# EAGLE design octo_driver (EAGLE 6.4)
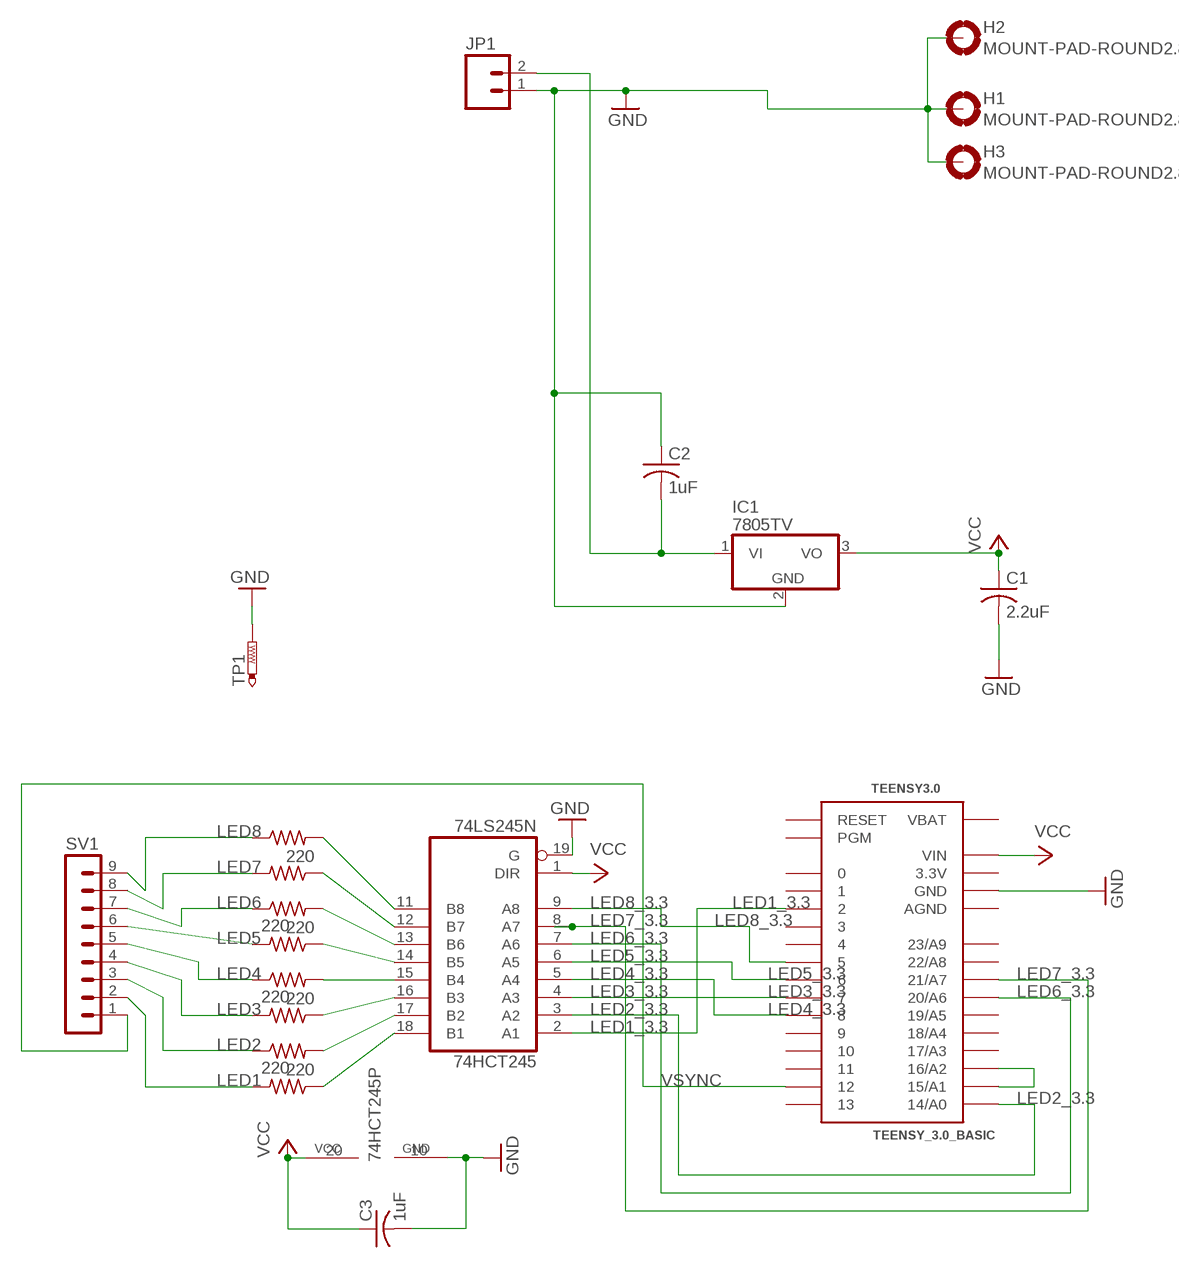
[diagram p0: schematic, sheet 1]

## Parts
74HCT245  74LS245N  [DIL20]
C1  2.2uF  C-US025-024X044  [C025-024X044]
C2  1uF  C-US025-024X044  [C025-024X044]
C3  1uF  C-US025-024X044  [C025-024X044]
H1  MOUNT-PAD-ROUND2.8  [2,8-PAD]
H2  MOUNT-PAD-ROUND2.8  [2,8-PAD]
H3  MOUNT-PAD-ROUND2.8  [2,8-PAD]
IC1  7805TV  [TO220V]
JP1  M02PTH  [1X02]
RLED1  220  R-US_0207/2V  [0207/2V]
RLED8  220  R-US_0207/2V  [0207/2V]
RLED9  220  R-US_0207/2V  [0207/2V]
RLED10  220  R-US_0207/2V  [0207/2V]
RLED11  220  R-US_0207/2V  [0207/2V]
RLED12  220  R-US_0207/2V  [0207/2V]
RLED13  220  R-US_0207/2V  [0207/2V]
RLED14  220  R-US_0207/2V  [0207/2V]
SV1  MA09-1  [MA09-1]
TEENSY3.0  TEENSY_3.0_BASIC  [TEENSY_3.0_BASIC]
TP1  PTR1B2,54  [B2,54]

## Nets
GND: 74HCT245.10(GND) 74HCT245.19(G) C1.2 C2.1 C3.2 H1.B2,8(MOUNT) H2.B2,8(MOUNT) H3.B2,8(MOUNT) IC1.2(GND) JP1.1 TEENSY3.0.GND TEENSY3.0.GND1(GND) TP1.TP
LED1: RLED14.2 SV1.2
LED1_3.3: 74HCT245.2(A1) TEENSY3.0.2
LED2: RLED13.1 SV1.3
LED2_3.3: 74HCT245.3(A2) TEENSY3.0.14/A0
LED3: RLED12.2 SV1.4
LED3_3.3: 74HCT245.4(A3) TEENSY3.0.7
LED4: RLED11.1 SV1.5
LED4_3.3: 74HCT245.5(A4) TEENSY3.0.8
LED5: RLED10.2 SV1.6
LED5_3.3: 74HCT245.6(A5) TEENSY3.0.6
LED6: RLED9.1 SV1.7
LED6_3.3: 74HCT245.7(A6) TEENSY3.0.20/A6
LED7: RLED8.2 SV1.8
LED7_3.3: 74HCT245.8(A7) TEENSY3.0.21/A7
LED8: RLED1.1 SV1.9
LED8_3.3: 74HCT245.9(A8) TEENSY3.0.5
N$1: C2.2 IC1.1(VI) JP1.2
N$3: TEENSY3.0.15/A1 TEENSY3.0.16/A2
N$16: 74HCT245.11(B8) RLED1.2
N$17: 74HCT245.12(B7) RLED8.1
N$19: 74HCT245.13(B6) RLED9.2
N$20: 74HCT245.14(B5) RLED10.1
N$21: 74HCT245.15(B4) RLED11.2
N$22: 74HCT245.16(B3) RLED12.1
N$23: 74HCT245.17(B2) RLED13.2
N$24: 74HCT245.18(B1) RLED14.1
VCC: 74HCT245.1(DIR) 74HCT245.20(VCC) C1.1 C3.1 IC1.3(VO) TEENSY3.0.VIN
VSYNC: SV1.1 TEENSY3.0.12
Unconnected: TEENSY3.0.0 TEENSY3.0.1 TEENSY3.0.3 TEENSY3.0.4 TEENSY3.0.9 TEENSY3.0.10 TEENSY3.0.11 TEENSY3.0.13 TEENSY3.0.17/A3 TEENSY3.0.18/A4 TEENSY3.0.19/A5 TEENSY3.0.22/A8 TEENSY3.0.23/A9 TEENSY3.0.PGM TEENSY3.0.RESET

## Power pins joined to a net without a drawn wire
3.3V: TEENSY3.0.3.3V TEENSY3.0.3.3V1(3.3V)
AGND: TEENSY3.0.AGND
VBAT: TEENSY3.0.VBAT

## Library data of the parts
74HCT245 = 74xx-us:74*245: Octal BUS TRANSCEIVER, 3-state
C1-C3 = rcl:C-US: CAPACITOR, American symbol
H1-H3 = holes:MOUNT-PAD-ROUND: MOUNTING PAD, round
IC1 = linear:78*: Positive VOLTAGE REGULATOR Source: http://cache.national.com/ds/LM/LM78L05.pdf http://www.fairchildsemi.com/ds/LM/LM7805.pdf
JP1 = SparkFun-Connectors:M02: Header 2 Standard 2-pin 0.1" header. Use with straight break away headers (SKU : PRT-00116), right angle break away headers (PRT-00553), swiss pins (PRT-00743), machine pins (PRT-00117), and female headers (PRT-00115). Molex polarized connector foot print use with SKU : PRT-08233 with associated crimp pins and housings.
RLED1 RLED8-RLED14 = rcl:R-US_: RESISTOR, American symbol
SV1 = penrose-con-lstb:MA09-1: PIN HEADER; OC_FARNELL: unknown; OC_NEWARK: unknown
TEENSY3.0 = Teensy3.0:TEENSY_3.0_BASIC: Basic Teensy 3.0 with none of the 'inner' pins enabled. See '+4', 'AllAnalogPins", and 'AllPins' packages for additional pin holes, as needed.
TP1 = testpad:PTR1: TEST PIN

## Board
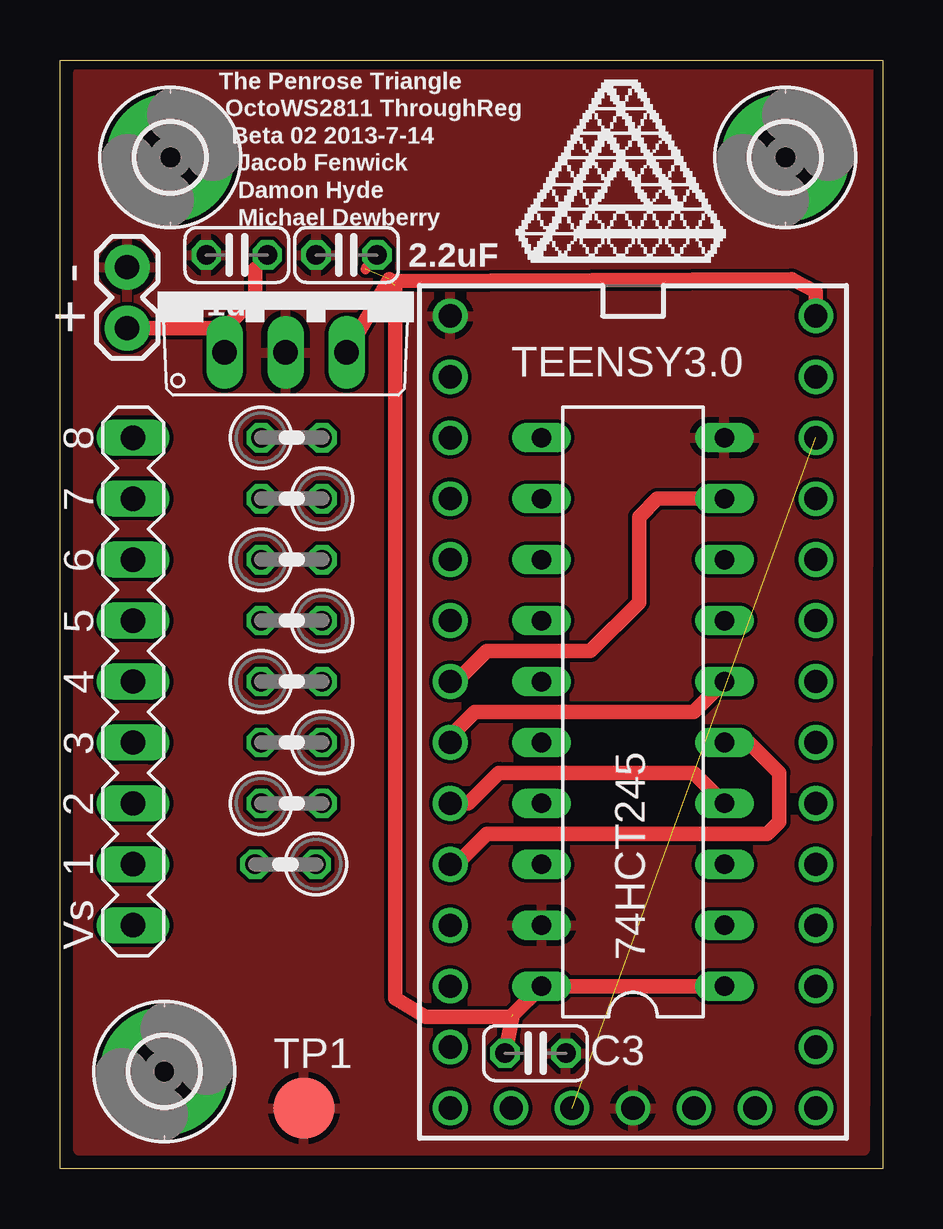
[diagram p1: board, top side]
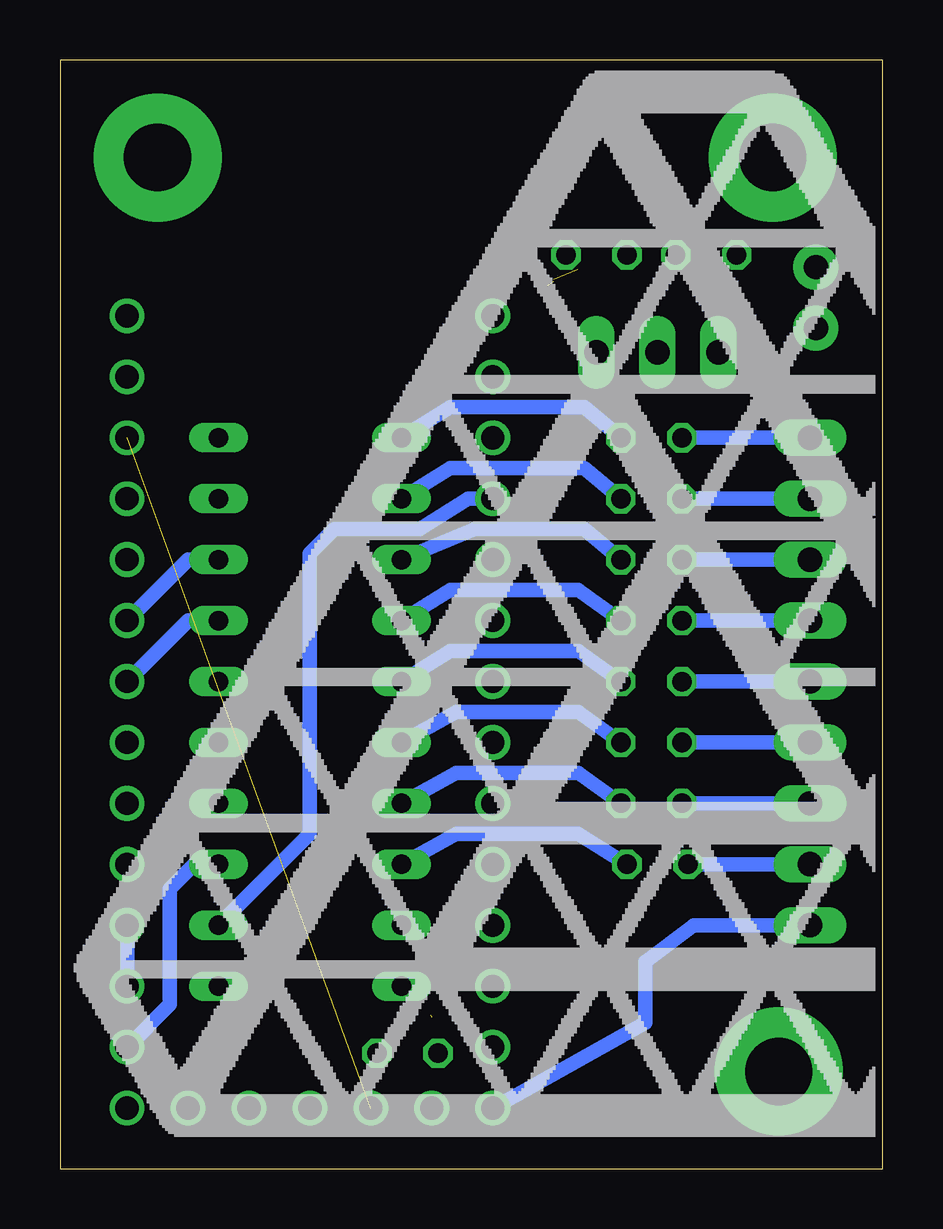
[diagram p2: board, bottom side, seen from below]

Size 34.29 x 46.23 mm. Coordinates in mm from the lower left corner, seen from the top.
Outline: 0,46.23 34.29,46.23 34.29,0 0,0 0,46.23
Copper layers (1*16): Top 0.0356mm / dielectric 1.5011mm / Bottom 0.0356mm
Design rules "LaenPCBOrder": minimum track width 6mil, minimum drill 13mil, track to track 6mil, track to pad 6mil, pad to pad 6mil, via to via 6mil, smd to smd 6mil, copper to edge 15mil, drill to drill 6mil, minimum pad ring 7mil, minimum via ring 7mil, stop-mask expansion 4mil, vias tented up to drill 0mil, thermal gap 10mil

### Footprints (pad centres in the part's own frame; a part is rotated, then mirrored left to right if it is on the bottom)
DIL20 = drill 0.813 long: 1 -11.43,-3.81; 2 -8.89,-3.81; 3 -6.35,-3.81; 4 -3.81,-3.81; 5 -1.27,-3.81; 6 1.27,-3.81; 7 3.81,-3.81; 8 6.35,-3.81; 9 8.89,-3.81; 10 11.43,-3.81; 11 11.43,3.81; 12 8.89,3.81; 13 6.35,3.81; 14 3.81,3.81; 15 1.27,3.81; 16 -1.27,3.81; 17 -3.81,3.81; 18 -6.35,3.81; 19 -8.89,3.81; 20 -11.43,3.81
C025-024X044 = drill 0.813 octagon: 1 -1.27,0; 2 1.27,0
2,8-PAD = drill 2.8 pad 5.334: B2,8 0,0
TO220V = drill 1.016 long: 1 -2.54,-2.54; 2 0,-2.54; 3 2.54,-2.54
1X02 = drill 1.016 pad 1.88: 1 0,0; 2 2.54,0
0207/2V = drill 0.813 octagon: 1 -1.27,0; 2 1.27,0
MA09-1 = drill 1.016 long: 1 -10.16,0; 2 -7.62,0; 3 -5.08,0; 4 -2.54,0; 5 0,0; 6 2.54,0; 7 5.08,0; 8 7.62,0; 9 10.16,0
TEENSY_3.0_BASIC = drill 0.965: 0 -7.62,13.97; 1 -7.62,11.43; 2 -7.62,8.89; 3 -7.62,6.35; 3.3V 7.62,11.43; 3.3V1 -2.54,-16.51; 4 -7.62,3.81; 5 -7.62,1.27; 6 -7.62,-1.27; 7 -7.62,-3.81; 8 -7.62,-6.35; 9 -7.62,-8.89; 10 -7.62,-11.43; 11 -7.62,-13.97; 12 -7.62,-16.51; 13 7.62,-16.51; 14/A0 7.62,-13.97; 15/A1 7.62,-11.43; 16/A2 7.62,-8.89; 17/A3 7.62,-6.35; 18/A4 7.62,-3.81; 19/A5 7.62,-1.27; 20/A6 7.62,1.27; 21/A7 7.62,3.81; 22/A8 7.62,6.35; 23/A9 7.62,8.89; AGND 7.62,13.97; GND -7.62,16.51; GND1 0,-16.51; PGM 2.54,-16.51; RESET 5.08,-16.51; VBAT -5.08,-16.51; VIN 7.62,16.51
B2,54 = smd 2.54 x 2.54: TP 0,0

### Placement (x,y rotation side)
74HCT245  23.88,19.05 90 top
C1  11.94,38.1 180 top
C2  7.37,38.1 0 top
C3  19.81,4.83 0 top
H1  4.34,4.06 0 top
H2  4.6,42.16 0 top
H3  30.23,42.16 0 top
IC1  9.4,36.58 0 top
JP1  2.79,37.59 270 top
RLED1  9.65,30.48 0 top
RLED8  9.65,27.94 180 top
RLED9  9.65,25.4 0 top
RLED10  9.65,22.86 180 top
RLED11  9.65,20.32 0 top
RLED12  9.65,17.78 180 top
RLED13  9.65,15.24 0 top
RLED14  9.4,12.7 180 top
SV1  3.05,20.32 90 top
TEENSY3.0  23.88,19.05 0 top
TP1  10.16,2.54 0 top
U$1  [PENROSELOGO_LOWDPI]  23.37,40.89 0 top
U$2  [PENROSELOGO_1.75IN]  8.13,20.32 0 top

### Tracks (layer width: path | path; a pad name or v marks a point on that pad's centre or on a via)
3.3V  (1 unrouted)
GND
  pour Top: 33.78,45.72 33.53,0.76 0.76,0.76 0.76,45.72
LED1
  Bottom 0.61: RLED14.2 SV1.2
LED1_3.3
  Bottom 0.61: TEENSY3.0.2 17.27,27.94 19.3,26.67 22.86,26.67 23.88,25.65 23.88,13.97 74HCT245.2
LED2
  Bottom 0.61: SV1.3 RLED13.1
LED2_3.3
  Bottom 0.61: 74HCT245.3 28.7,12.7 29.72,11.68 29.72,6.86 TEENSY3.0.14/A0
LED3
  Bottom 0.61: RLED12.2 SV1.4
LED3_3.3
  Top 0.61: TEENSY3.0.7 17.02,15.24 18.29,16.51 26.42,16.51 74HCT245.4
LED4
  Bottom 0.61: SV1.5 RLED11.1
LED4_3.3
  Top 0.61: TEENSY3.0.8 16.51,12.7 17.78,13.97 29.46,13.97 29.97,14.48 29.97,16.51 28.7,17.78 74HCT245.5
LED5
  Bottom 0.61: RLED10.2 SV1.6
LED5_3.3
  Top 0.61: TEENSY3.0.6 16.26,18.03 17.27,19.05 26.42,19.05 74HCT245.6
LED6
  Bottom 0.61: SV1.7 RLED9.1
LED6_3.3
  Bottom 0.61: 74HCT245.7 28.96,22.86 TEENSY3.0.20/A6
LED7
  Bottom 0.61: RLED8.2 SV1.8
LED7_3.3
  Bottom 0.61: 74HCT245.8 28.96,25.4 TEENSY3.0.21/A7
LED8
  Bottom 0.61: SV1.9 RLED1.1
LED8_3.3
  Top 0.61: TEENSY3.0.5 16.51,20.32 17.78,21.59 22.1,21.59 24.13,23.62 24.13,27.18 24.89,27.94 74HCT245.9
N$1
  Top 0.406: 8.13,37.53 C2.2
  Top 0.61: JP1.2 6.86,35.05 | 6.86,35.05 8.13,36.32 8.13,37.53 | 6.86,35.05 IC1.1
N$3
  Bottom 0.61: TEENSY3.0.15/A1 TEENSY3.0.16/A2
N$16
  Bottom 0.61: RLED1.2 12.45,31.75 18.03,31.75 74HCT245.11
N$17
  Bottom 0.61: 74HCT245.12 18.03,29.21 12.45,29.21 RLED8.1
N$19
  Bottom 0.61: RLED9.2 12.45,26.67 17.02,26.67 74HCT245.13
N$20
  Bottom 0.61: 74HCT245.14 18.03,24.13 12.7,24.13 RLED10.1
N$21
  Bottom 0.61: 74HCT245.15 18.03,21.59 12.7,21.59 RLED11.2
N$22
  Bottom 0.61: 74HCT245.16 17.78,19.05 12.7,19.05 RLED12.1
N$23
  Bottom 0.61: 74HCT245.17 17.78,16.51 12.7,16.51 RLED13.2
N$24
  Bottom 0.61: RLED14.1 12.7,13.97 17.78,13.97 74HCT245.18
VCC  (3 unrouted)
  Top 0.406: 12.73,37.5 C1.1
  Top 0.61: C3.1 18.86,6.42 74HCT245.20 74HCT245.1 | TEENSY3.0.VIN 31.5,36.58 30.48,37.08 13.72,37.01 13.72,37.08 IC1.3 | 13.97,36.83 13.97,7.11 15.24,6.35 18.8,6.35
VSYNC
  Bottom 0.61: TEENSY3.0.12 9.91,6.1 9.91,8.64 7.87,10.16 SV1.1

### Text on the board
tNames: The Penrose Triangle / OctoWS2811 ThroughReg / Beta 02 2013-7-14 / Jacob Fenwick / Damon Hyde / Michael Dewberry | + -